# Altium schematic sheet LeadAcidBatteryCharger.SchDoc
size A2; SheetNumber: 1; SheetTotal: 1
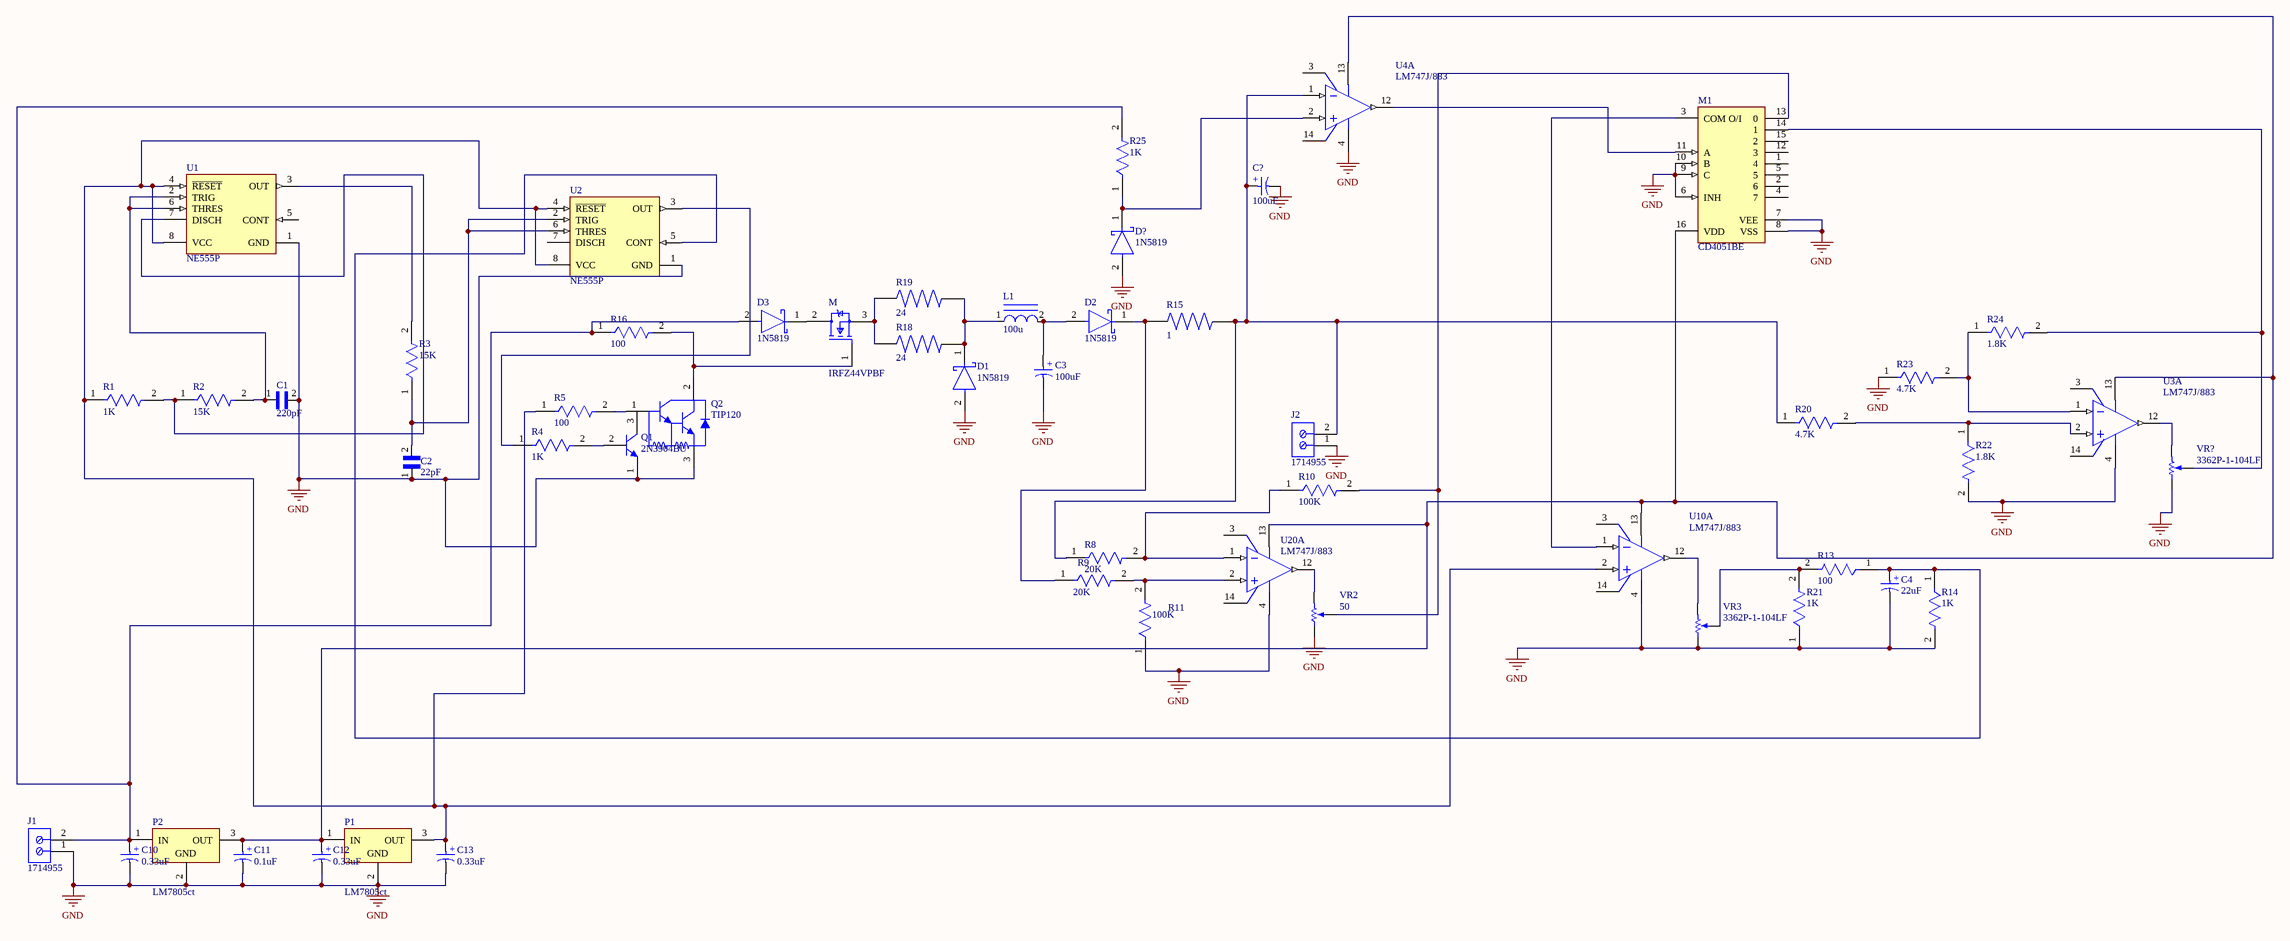
[diagram p0: LeadAcidBatteryCharger.SchDoc]

## Parts
C1  220pF  [FP-VY2222M35Y5US6TV7-MFG]
C2  22pF  [FP-VY2222M35Y5US6TV7-MFG]
C3  100uF  [WCAP-ATLL_D6.3H15]
C4  22uF  [WCAP-ATLL_D6.3H15]
C10  0.33uF  [WCAP-ATLL_D6.3H15]
C11  0.1uF  [WCAP-ATLL_D6.3H15]
C12  0.33uF  [WCAP-ATLL_D6.3H15]
C13  0.33uF  [WCAP-ATLL_D6.3H15]
C?  100uF  [WCAP-ATLL_D6.3H15]
D1  1N5819  [FP-1N5819-E3-54-MFG]
D2  1N5819  [FP-1N5819-E3-54-MFG]
D3  1N5819  [FP-1N5819-E3-54-MFG]
D?  1N5819  [FP-1N5819-E3-54-MFG]
J1  1714955  [PHOE-1714955_V]
J2  1714955  [PHOE-1714955_V]
L1  100u  [FP-DR127-MFG]
M  IRFZ44VPBF  [FP-PG-TO220-3-MFG]
M1  CD4051BE  [N0016A]
P1  LM7805ct  [NDE0003A]
P2  LM7805ct  [NDE0003A]
Q1  2N3904BU  [FAIR-TO-92]
Q2  TIP120  [ONSC-TO-220-3-221A-09]
R1  1K  [FP-MRS25-MFG]
R2  15K  [FP-MRS25-MFG]
R3  15K  [FP-MRS25-MFG]
R4  1K  [FP-MRS25-MFG]
R5  100  [FP-MRS25-MFG]
R8  20K  [FP-MRS25-MFG]
R9  20K  [FP-MRS25-MFG]
R10  100K  [FP-MRS25-MFG]
R11  100K  [FP-MRS25-MFG]
R13  100  [FP-MRS25-MFG]
R14  1K  [FP-MRS25-MFG]
R15  1  [FP-SQP500-MFG]
R16  100  [FP-MRS25-MFG]
R18  24  [FP-SQP500-MFG]
R19  24  [FP-SQP500-MFG]
R20  4.7K  [FP-MRS25-MFG]
R21  1K  [FP-MRS25-MFG]
R22  1.8K  [FP-MRS25-MFG]
R23  4.7K  [FP-MRS25-MFG]
R24  1.8K  [FP-MRS25-MFG]
R25  1K  [FP-MRS25-MFG]
U1  NE555P  [P0008A]
U2  NE555P  [P0008A]
U3  LM747J/883  [J0014A]  (part A of 3)
U4  LM747J/883  [J0014A]  (part A of 3)
U10  LM747J/883  [J0014A]  (part A of 3)
U20  LM747J/883  [J0014A]  (part A of 3)
VR2  50  [BOUR-3362P]
VR3  3362P-1-104LF  [BOUR-3362P]
VR?  3362P-1-104LF  [BOUR-3362P]

## Nets
GND: C1.2 C2.1 C3.2(N) C4.2(N) C10.2(N) C11.2(N) C12.2(N) C13.2(N) C?.2(N) D1.2(A) D?.2(A) J1.1 J2.1 M1.6(INH) M1.7(VEE) M1.8(VSS) M1.9(C) M1.10(B) P1.2(GND) P2.2(GND) Q1.1(E) Q2.3(E) R11.1 R14.2 R21.1 R22.2 R23.1 U1.1(GND) U2.1(GND) U3.4(V-) U4.4(V-) U10.4(V-) U20.4(V-) VR2.1(CCW) VR3.1(CCW) VR?.1(CCW)
NetC1_1: C1.1 R2.2 U1.2(TRIG) U1.6(THRES)
NetC2_2: C2.2 R3.1 U2.2(TRIG) U2.6(THRES)
NetC3_1: C3.1(P) D2.2(A) L1.2
NetC4_1: C4.1(P) R13.1 R14.1 U2.5(CONT)
NetC10_1: C10.1(P) D3.2(A) J1.2 P2.1(IN) R16.1 R25.2
NetC11_1: C11.1(P) C12.1(P) M1.16(VDD) P1.1(IN) P2.3(OUT) U3.13(VA+) U4.13(VA+) U10.13(VA+) U20.13(VA+)
NetC13_1: C13.1(P) P1.3(OUT) R1.1 R5.1 U1.4(~{RESET}) U1.8(VCC) U2.4(~{RESET}) U2.8(VCC) U10.2(INA+)
NetC?_1: C?.1(P) J2.2 R8.1 R15.2 R20.1 U4.1(INA-)
NetD1_1: D1.1(C) L1.1 R18.2 R19.2
NetD2_1: D2.1(C) R9.1 R15.1
NetD3_1: D3.1(C) M.2(DRAIN)
NetD?_1: D?.1(C) R25.1 U4.2(INA+)
NetM1_3: M1.3(COM_O/I) U10.1(INA-)
NetM1_11: M1.11(A) U4.12(OUTA)
NetM1_13: M1.13(0) R10.2 VR2.2(S)
NetM1_14: M1.14(1) R24.2 VR?.2(S)
NetM_1: M.1(GATE) Q2.2(C) R16.2
NetM_3: M.3(SOURCE) R18.1 R19.1
NetQ1_2: Q1.2(B) R4.2
NetQ2_1: Q2.1(B) R5.2
NetR1_2: R1.2 R2.1 U1.7(DISCH)
NetR3_2: R3.2 U1.3(OUT)
NetR4_1: R4.1 U2.3(OUT)
NetR8_2: R8.2 R10.1 U20.1(INA-)
NetR9_2: R9.2 R11.2 U20.2(INA+)
NetR13_2: R13.2 R21.2 VR3.2(S)
NetR20_2: R20.2 R22.1 U3.2(INA+)
NetR23_2: R23.2 R24.1 U3.1(INA-)
NetU3_12: U3.12(OUTA) VR?.3(CW)
NetU10_12: U10.12(OUTA) VR3.3(CW)
NetU20_12: U20.12(OUTA) VR2.3(CW)

Not connected (* = marked no-connect by the designer): M1 1(4) 2(6) 4(7) 5 12(3) 15(2); Q1 3(C); U1 5(CONT); U2 7(DISCH); U3 3(OFS_NULLA) 14(OFS_NULLA); U4 3(OFS_NULLA) 14(OFS_NULLA); U10 3(OFS_NULLA) 14(OFS_NULLA); U20 3(OFS_NULLA) 14(OFS_NULLA)

## Notes on the sheet
- (in symbol CMP-03913-53914459-1) +

## Library data of the parts
C1 C2 = AR215C104K4R: AR 100nF Ceramic Multilayer Cap,50V dc,+125C,X7R Dielectric,+/-10%,Through Hole | AVX AR215C104K4R; SnapEDA_Link: https://www.snapeda.com/parts/AR215C104K4R/AVX/view-part/?ref=snap; Package: Radial AVX; Value: *; MF: AVX; MP: AR215C104K4R; Check_prices: https://www.snapeda.com/parts/AR215C104K4R/AVX/view-part/?ref=eda
C3 C4 C10-C13 C? = CMP-03913-53914459-1: 860160573012 WCAP-ATLL Aluminum Electrolytic Capacitors; Leakage Current: 35µA; Voltage Rating: 35V; Ripple Current: 378mA; Impedance: 470mΩ; Pitch: 2.5mm; Capacitance: 100µF; Material: Aluminium; Life (Hours): 3000hours; Tolerance: 20%; Polarity: Polar; RoHS: Compliant; Height - Seated (Max): 16.51mm; NexarPartId: 53914459; Length: 15mm; Lead Pitch: 2.4892mm; Max Operating Temperature: 105°C; Packaging: Tape & Box (TB); Height: 15mm; Mount: Through Hole; Case/Package: Radial; Diameter: 6.3mm; Min Operating Temperature: -55°C
D1-D3 D? = CMP-02539-000037-2: DIODE SCHOTTKY 40V 1A DO204AL; Capacitance: 110pF; Element Configuration: Single; Peak Non-Repetitive Surge Current: 25A; Forward Voltage: 900mV; Polarity: Standard; Peak Reverse Current: 1mA; Max Operating Temperature: 125°C; Forward Current: 1A; Package Quantity: 1; Average Rectified Current: 1A; Voltage: 40V; Radiation Hardening: No; Current: 1A; Max Reverse Voltage (DC): 40V; Height: 2.7mm; Output Current: 1A; Lead Free: Lead Free; Diameter: 2.7mm; Min Operating Temperature: -65°C; Max Repetitive Reverse Voltage (Vrrm): 40V; Number of Pins: 2; Width: 2.7mm; Length: 5.2mm; Current Rating: 1A; Packaging: Tape and Reel; Mount: Through Hole; Max Forward Surge Current (Ifsm): 25A; Voltage Rating (DC): 40V
J1 J2 = CMP-2000-05797-1: PC Terminal Block, Pitch 6.35 mm, 1 x 2 Position, Height 21.5 mm, Tail Lenght 5.1 mm, RoHS, Bulk; Manufacturer: Phoenix Contact; Package Description: PC Terminal Block, Pitch 6.35 mm, 1 x 2 Position, Height 21.5 mm, Tail Lenght 5.1 mm; Datasheet URL: http://media.digikey.com/pdf/Data%20Sheets/Phoenix%20Contact%20PDFs/1714955.pdf; Package Reference: 1714955; Manufacturer URL: http://www.phoenixcontact.com/; Datasheet Version: 02/2010; Mounting Technology: ThroughHole
L1 = CMP-00112-51190308-2: DR127-330-R Inductor Power Shielded Drum Core 33uH 20% 100KHz Ferrite 3.23A 60mOhm DCR T/R; Series Resistance: 60mΩ; Saturation Current: 6.22A; Inductance: 33µH; Min Operating Temperature: -40°C; REACH SVHC: No SVHC; Self Resonant Frequency: 100kHz; Tolerance: 20%; Packaging: Cut Tape; Width: 12.4968mm; Termination: SMD/SMT; Lead Free: Lead Free; Test Frequency: 100kHz; Shielding: Shielded; Case/Package: Nonstandard; RoHS: Compliant; Max Operating Temperature: 125°C; RMS Current (Irms): 3.23A; Height - Seated (Max): 8.001mm; Number of Pins: 2; Radiation Hardening: No; Resistance: 60mΩ; Composition: Wirewound; Weight: 5.896701g; Mount: Surface Mount; Max DC Current: 6.22A; Height: 8mm; Depth: 12.5mm; Core Material: Ferrite; Military Standard: Not; DC Resistance (DCR): 60mΩ; Inductance Tolerance: 20%; NexarPartId: 51190308; Length: 12.5mm; Schedule B: 8504500000, 8504500000; Current Rating: 3.23A
M = CMP-32901-001154-1: MOSFET N-CH 60V 55A TO220AB; Polarization: N; Power Dissipation: 115W; Rds On Max: 16.5mR; Gate to Source Voltage (Vgs): 20V; Threshold Voltage: 4V; Turn-On Delay Time: 13ns; Element Configuration: Single; Input Capacitance: 1.812nF; Turn-Off Delay Time: 40ns; Mount: Through Hole; Drain to Source Voltage (Vdss): 60V; Max Dual Supply Voltage: 60V; Length: 0.42inch; Height: 0.65inch; Width: 0.19inch; Packaging: Rail/Tube; Halogen Free: Halogen Free; Number of Pins: 3; Continuous Drain Current (ID): 55A; Drain to Source Resistance: 16.5mR; Series: HEXFET®; RoHS Compliant: Yes; Reach SVHC Compliant: Yes; Drain to Source Breakdown Voltage: 60V; Max Operating Temperature: 175°C; Case/Package: TO-220; Max Power Dissipation: 115W; Lead Free: Lead Free; Min Operating Temperature: -55°C
M1 = CMP-1575-00059-4: CMOS Single 8-Channel Analog Multiplexer/Demultiplexer with Logic-Level Conversion, N0016A, TUBE; Manufacturer: Texas Instruments; VCC(Max)(V): 18; ICC(Typ)(mA): 0.00008; Output Drive (IOL/IOH)(Max)(mA): 1; Bandwidth(Max)(MHz): 20; Rating: Military; VCC(Min)(V): 5; Configuration: 1 X 1：8 MUX; Crosstalk: Yes; Ron(Max)(Ohms): 240; Ron(Typ)(Ohms): 125; DatasheetVersion: SCHS047G; Output Type: CMOS; PackageVersion: http://www.ti.com/lit/ml/mpdi002c/mpdi002c.pdf; Operating Temperature Range(C): -55 to 125; Generic Part Number: CD4051B; PackageReference: N0016A; Code_JEDEC: MS-001
P1 P2 = CMP-0062-02468-3: Series 3-Terminal Positive Regulators, 3-pin TO-220; Manufacturer: Texas Instruments; PowerWise: N; CompType: LDO IC; PackageTopMarking: NSUZXYTTE#*LM340T5*7805 P+; RoHS: N; ComponentLink1URL: http://www.ti.com/general/docs/lit/getliterature.tsp?genericPartNumber=LM340-N&fileType=pdf; PinCount: 3; PackageReference: NDE0003A; ComponentLink1Description: Datasheet URL; PackageDescription: TO-220, Molded, 3 Lead, Straight
Q1 = CMP-2000-04944-1: NPN General-Purpose Amplifier, 40 V VCEO, 0.2 A, -55 to 150 degC, 2-Pin TO-92, RoHS, Bulk; Manufacturer: FairchildSemiconductor; Maximum Collector Base Voltage: 60V; Minimum DC Current Gain: 40@0.1mA@1V; Maximum Collector Emitter Voltage: 40V; Maximum DC Collector Current: 0.2A; Rad Hard: No; Maximum Operating Frequency: 300(Min)MHz; Maximum Collector Emitter Saturation Voltage: 0.2@1mA@10mA; Maximum Power Dissipation: 625mW; Package Description: 3-Pin Transistor Outline Package, Body Dia 4.79 mm, Pitch 1.27 mm; Package Reference: TO-92; Pin Count: 3; Operating Temperature: -55to150degC; Category: GPBJT; Manufacturer URL: https://www.fairchildsemi.com/; Datasheet URL: https://datasheet.ciiva.com/4722/2n3904-82270-4722369.pdf; Package: 3TO-92; Packaging: Bulk; Type: NPN; Datasheet Version: Rev. 1.1.0, 10/2014; Mounting: ThroughHole
Q2 = CMP-1047-00140-1: Plastic Medium-Power, Complementary Silicon Transistor, 3-Pin TO-220, Tube; Manufacturer: On Semiconductor; IC Continuous (A): 5; Polarity: NPN; ComponentLink2URL: http://www.onsemi.cn/pub_link/Collateral/TIP120-D.PDF; Packing: Tube; PartNumber: TIP120; ComponentLink3Description: Package Specification; PackageDescription: 3-Pin Flange Mount, Vertical Straight Lead, Body 9.97 x 4.445 mm, Pitch 2.54 mm; Mounting Technology: Through Hole; ComponentLink1URL: http://www.onsemi.com/; PackageVersion: Rev. AG, 09/2011; ComponentLink1Description: Manufacturer URL; PackageReference: TO-220-3-221A-09; ComponentLink2Description: Datasheet; RoHS: FALSE; DatasheetVersion: Rev. 8; ComponentLink3URL: http://www.onsemi.com/pub_link/Collateral/221A-09.PDF
R1-R5 R8-R11 R13 R14 R16 R20-R25 = CMP-00030-42757237-1: MRS25000C1000FRP00 Resistor, 100 Ohm, ± 1%, 600 mW, Axial Leaded, Metal Film (Thin Film), Professional; Max Power Dissipation: 600mW; Resistance: 100Ω; Voltage Rating: 350V; Temperature Coefficient: 50ppm/°C; Lead Diameter: 600µm; RoHS: Compliant; Radiation Hardening: No; Schedule B: 8533210090, 8533210090; Length: 6.5mm; Packaging: Tape & Reel (TR); Number of Terminations: 2; Mount: Through Hole; Width: 2.5mm; Tolerance: 1%; Military Standard: Not; Voltage Rating (DC): 350V; Contact Plating: Tin; Number of Pins: 2; Max Operating Temperature: 155°C; NexarPartId: 42757237; Diameter: 2.5mm; Composition: Metal Film, Thin Film; REACH SVHC: Unknown; Power Rating: 600mW; Lead Free: Lead Free; Termination: Axial; Case/Package: Axial; Min Operating Temperature: -55°C
R15 R18 R19 = SQP500JB-0R33: 330 mOhms Â±5% 5W Through Hole Resistor Axial Anti-Arc, Flame Proof, Moisture Resistant, Safety Wirewound; MF: Yageo; SnapEDA_Link: https://www.snapeda.com/parts/SQP500JB-0R33/Yageo/view-part/?ref=snap; Package: None; Value: *; MP: SQP500JB-0R33; Check_prices: https://www.snapeda.com/parts/SQP500JB-0R33/Yageo/view-part/?ref=eda
U1 U2 = CMP-2000-04954-1: Precision Timer, 4.5 to 16 V, 0 to 70 degC, 8-Pin DIP, Pb-Free, Tube; Manufacturer: TexasInstruments; Maximum High Level Output Current: -200mA; Number of Internal Timers: 1; Operating Supply Voltage: 5; Maximum Low Level Output Current: 200mA; Rad Hard: No; Packaging: Rail/Tube; Manufacturer URL: http://www.ti.com/; Package Reference: P8; Package Description: 8-Pin Double In-line Package, Body 9.59 x 6.35 mm, Pitch 2.54 mm; Package URL: http://www.ti.com/lit/ml/mpdi001b/mpdi001b.pdf; Type: Standard; Datasheet URL: http://www.ti.com/general/docs/lit/getliterature.tsp?genericPartNumber=NE555&fileType=pdf; Category: Timer; Package: 8PDIP; Datasheet Version: Rev. I, 09/2014
U3 U4 U10 U20 = CMP-0055-00145-3: Dual Operational Amplifier, 14-pin CerDIP; Manufacturer: Texas Instruments; High-Reliability: Y; PackageTopMarking: NSZSSXXYYA*LM747J/883 Q; PowerWise: N; CompType: Amplifiers; Package Reference: J0014A; RoHS: N; ComponentLink1Description: Datasheet URL; PackageDescription: Cerdip, .400 x .310in Body, 14 Lead, .300in Centers, .100in Pitch; PinCount: 14; ComponentLink1URL: http://www.ti.com/general/docs/lit/getliterature.tsp?genericPartNumber=LM747QML&fileType=pdf
VR2 VR3 VR? = CMP-1747-00003-1: Square Trimpot(R) Trimming Potentiometer, 100 KOhm, 300 V, -55 to 125 degC, 3-Pin THD, RoHS, Tube; Voltage Rating: 250 V; Case\Package: Axial; Tolerance: 1%; Power Rating: 250 mW; Resistance: 1 mohm; RoHSCompliant: true; ComponentLink2URL: http://www.bourns.com/docs/Product-Datasheets/3362.pdf; ComponentLink1Description: Manufacturer URL; DatasheetVersion: May-16; Package Quantity: 200; ComponentLink2Description: Datasheet; Min Operating Temperature: -55 degC; Mount: Through Hole; PackageDescription: 3-Pin Through Hole Device, Body 6.6 x 6.99 mm, Pitch 2.54 mm; Length: 0.248 inch; ComponentLink1URL: http://www.bourns.com/; PackageReference: 3326P; Max Operating Temperature: 155 degC; Packaging: Bulk